# Altium project amplifier.PrjPCB
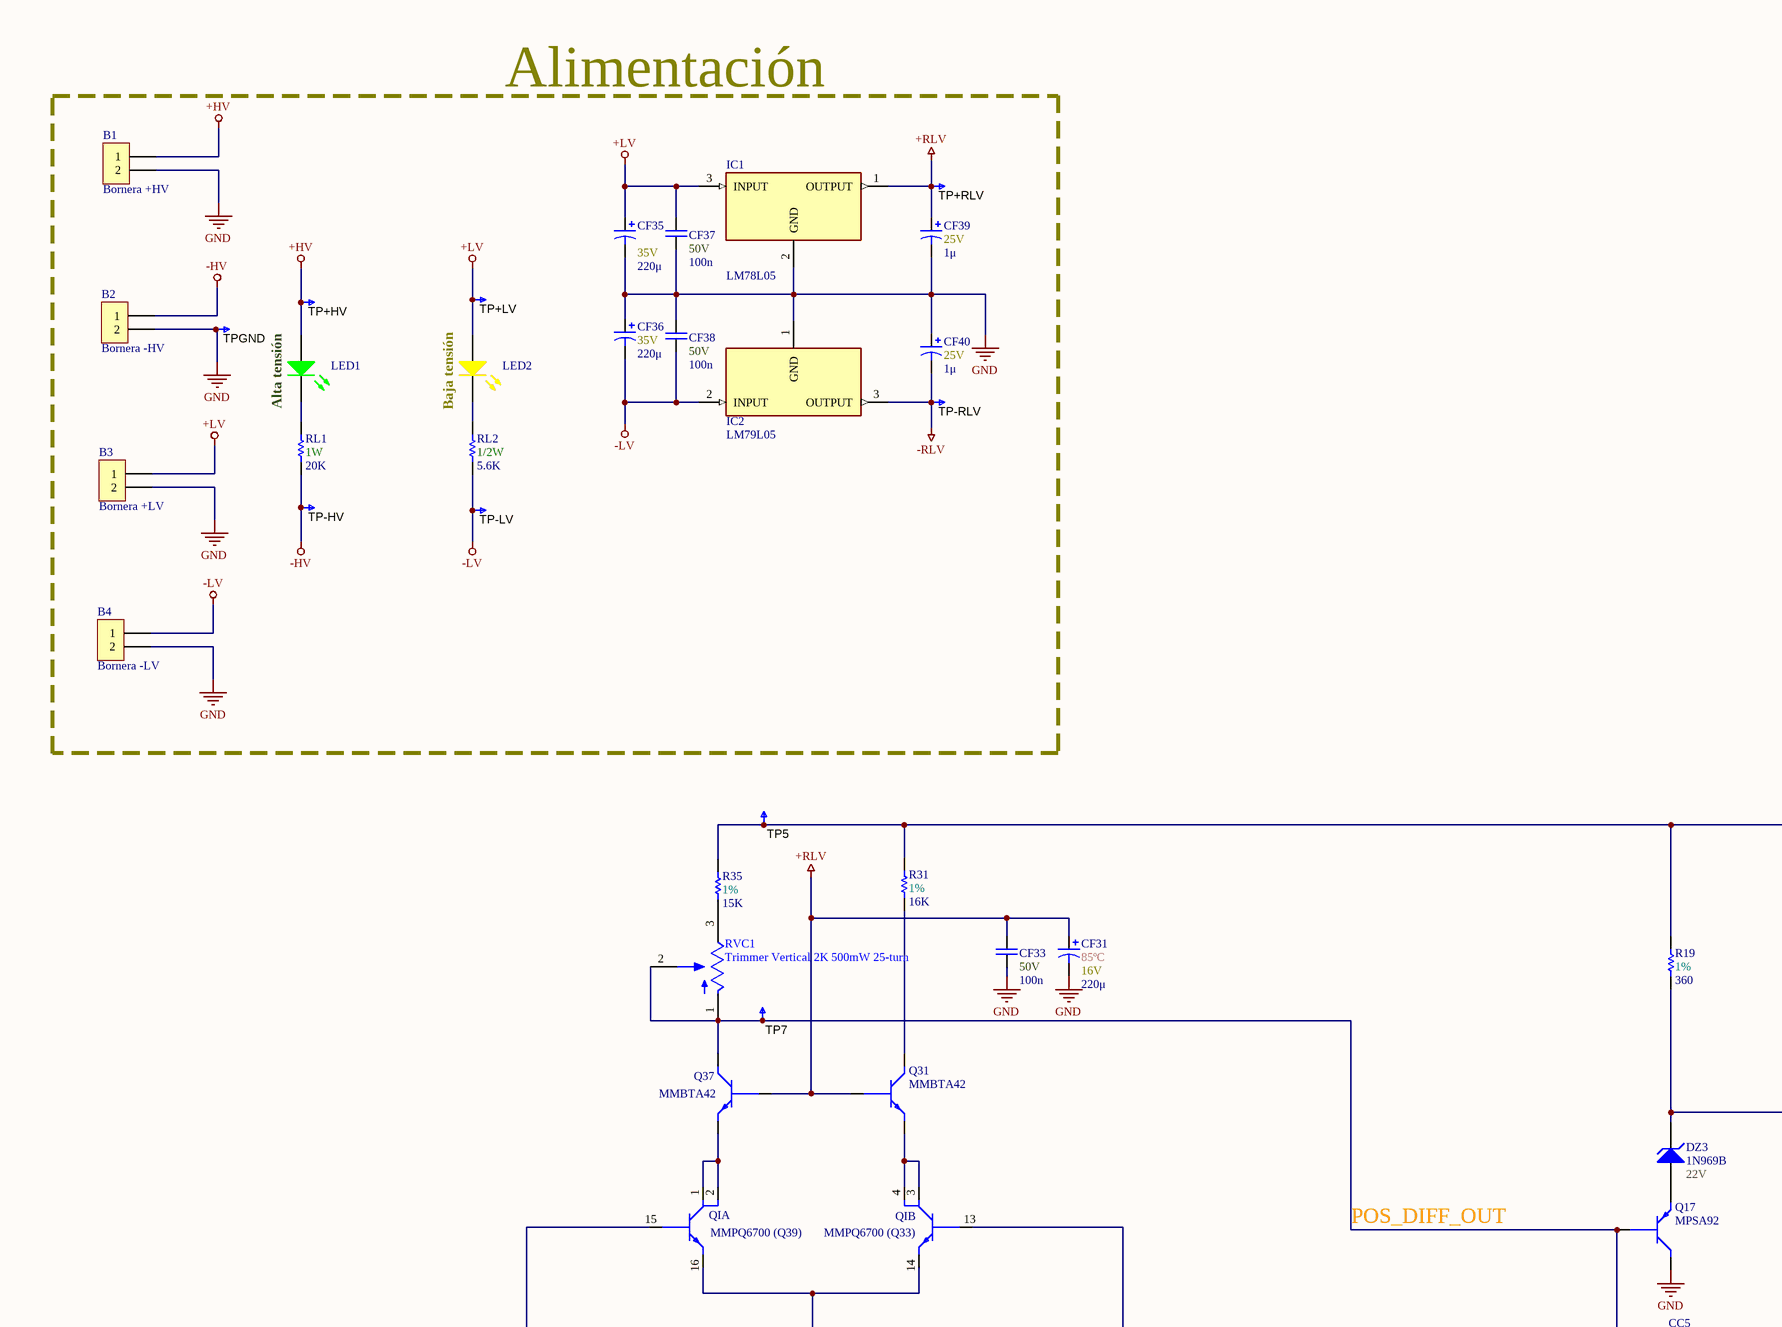
[diagram p0: amplifier.SchDoc, top left]
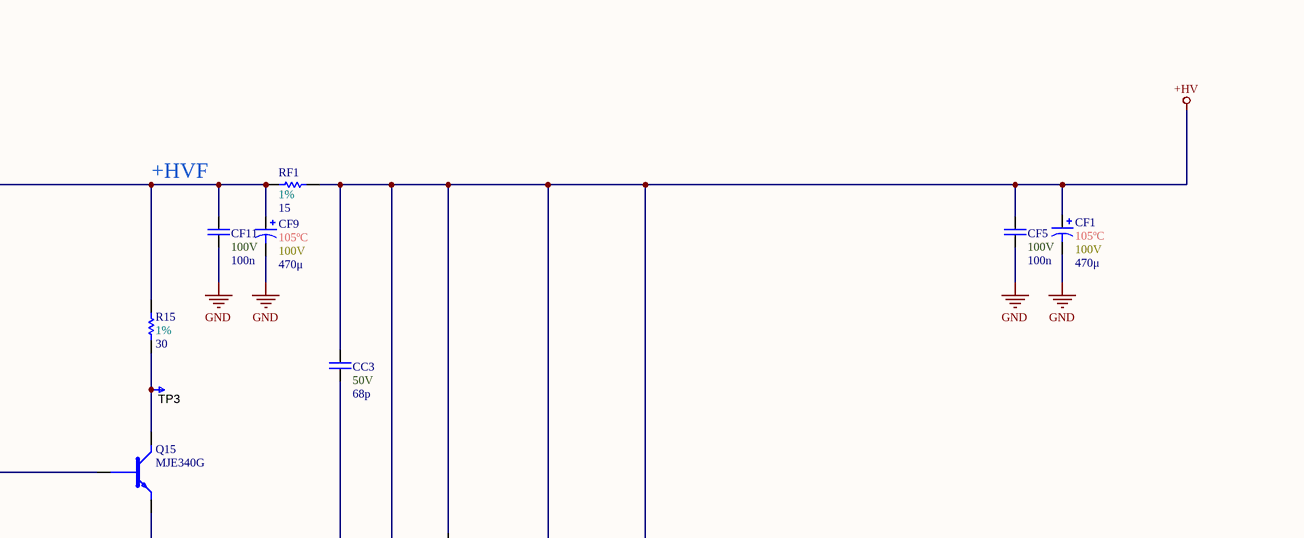
[diagram p1: amplifier.SchDoc, top right]
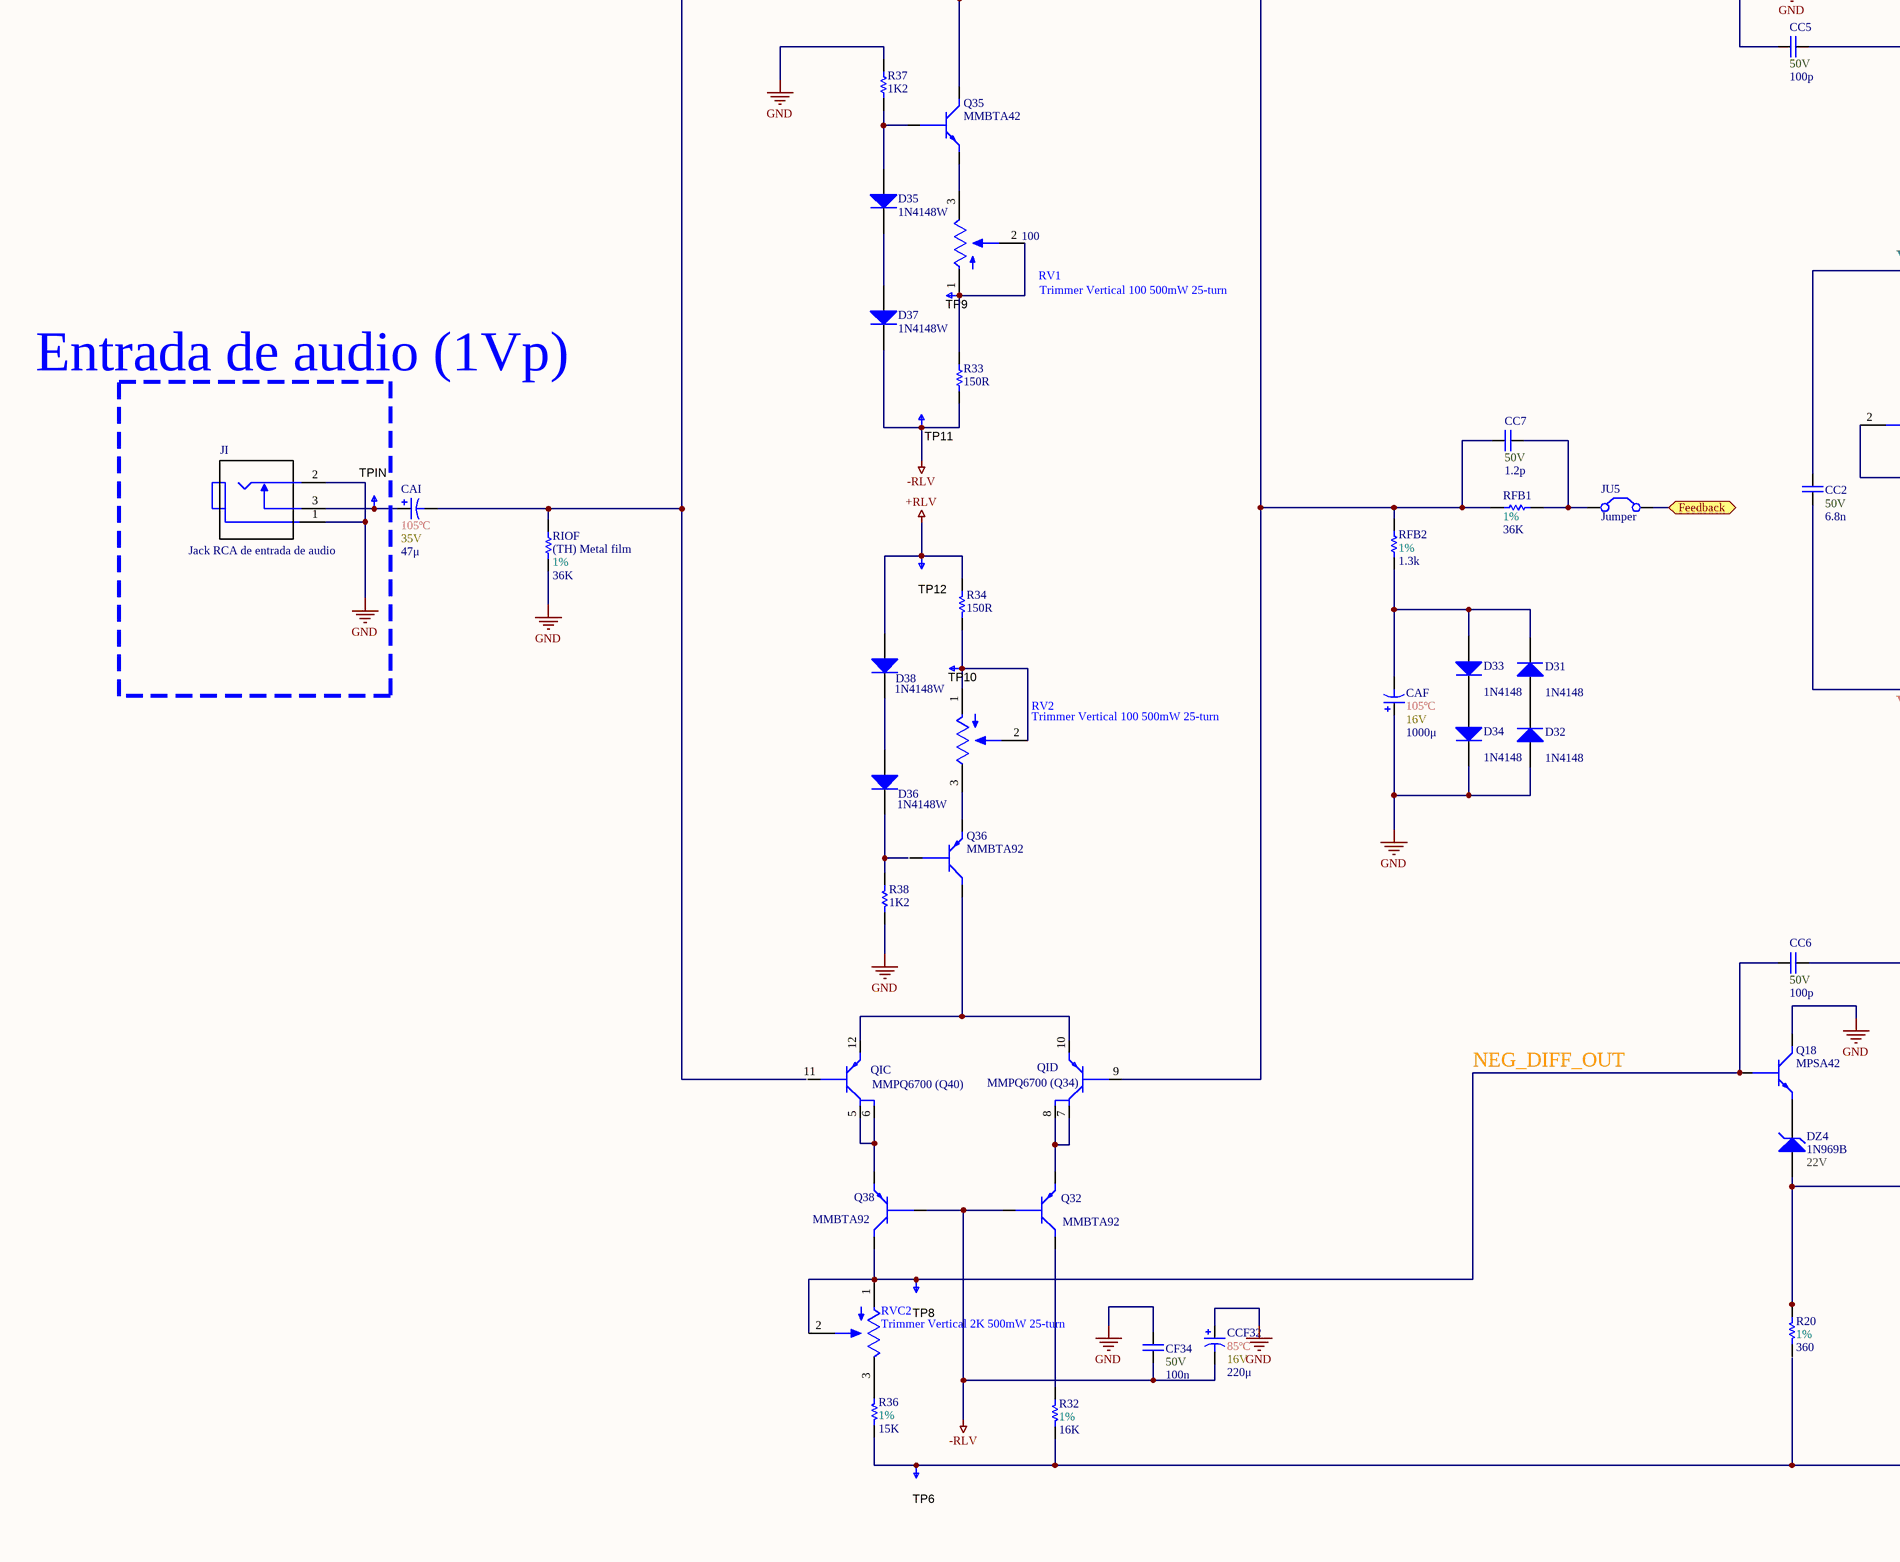
[diagram p2: amplifier.SchDoc, bottom left]
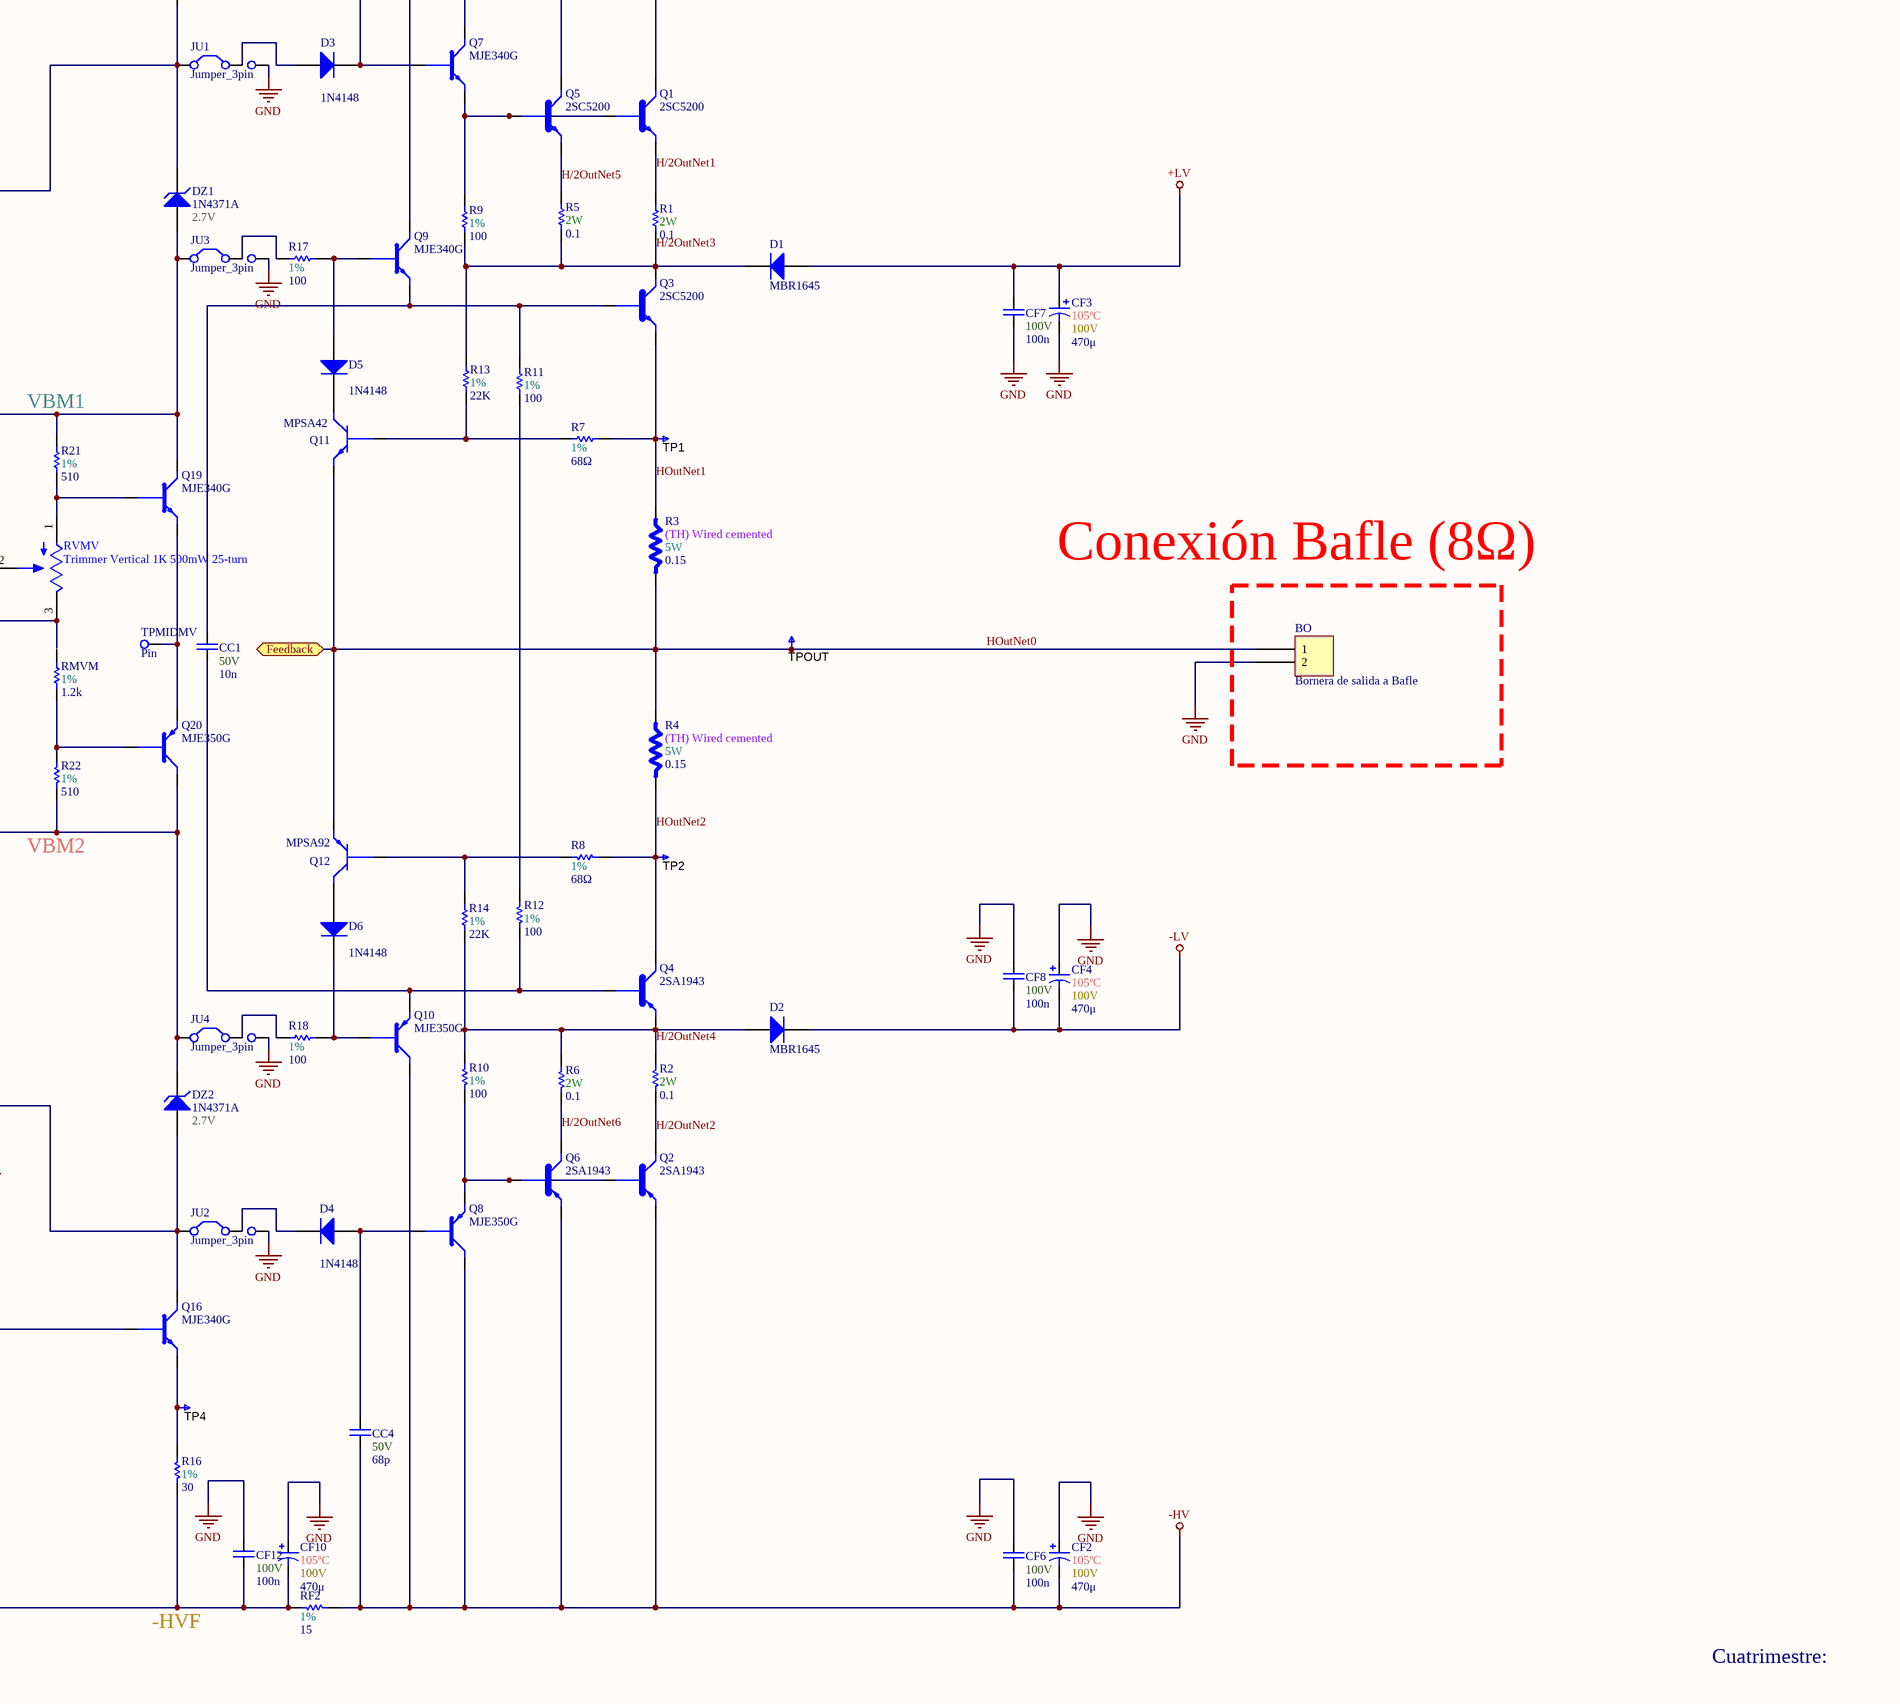
[diagram p3: amplifier.SchDoc, bottom right]
Cuatrimestre: 1º 2019; Grupo: Irusta - Luna - Niero - Romero; Organización: Facultad de ingeniería - UBA; Project Name: Proyecto de Circuitos electrónicos 2 - Amplificador clase G
1 sheet, 154 parts. Net scope: flat (ports and power ports of the same name join across sheets).
Board file: amplifier.PcbDoc

## Sheet amplifier.SchDoc
size A1

### Parts
B1  Bornera +HV  [TE-C-282822-2-C-PLUGGED]
B2  Bornera -HV  [TE-C-282822-2-C-PLUGGED]
B3  Bornera +LV  [TE-C-282822-2-C-PLUGGED]
B4  Bornera -LV  [TE-C-282822-2-C-PLUGGED]
BO  Bornera de salida a Bafle  [TE 8PCV-02-006]
CAF  value 1000μ  Temperature: 105ºC  Voltage: 16V  [Al. Electrolytic 10.0mmx17.0mmx5.0mm-CLEAN]  (hidden comment: Al. Elect. 1000u 16V 20% 105º)
CAI  value 47μ  Temperature: 105ºC  Voltage: 35V  [Al. Electrolytic 6.3mmx11.0mmx2.5mm-CLEAN]  (hidden comment: Al. Elect. 47u 35V 20% 105º)
CC1  value 10n  Voltage: 50V  [Cer. pitch 5.0mm height 5.5mm]  (hidden comment: Cer. 10n 50V 10%)
CC2  value 6.8n  Voltage: 50V  [Cer. pitch 2.5mm height 5.0mm]  (hidden comment: Cer. 6.8n 50V 10%)
CC3  value 68p  Voltage: 50V  [Cer. pitch 5.08mm height 6.00mm]  (hidden comment: Cer. 68p 50V 10%)
CC4  value 68p  Voltage: 50V  [Cer. pitch 5.08mm height 6.00mm]  (hidden comment: Cer. 68p 50V 10%)
CC5  value 100p  Voltage: 50V  [Cer. pitch 5.08mm height 6.00mm]  (hidden comment: Cer. 100p 50V 10%)
CC6  value 100p  Voltage: 50V  [Cer. pitch 5.08mm height 6.00mm]  (hidden comment: Cer. 100p 50V 10%)
CC7  value 1.2p  Voltage: 50V  [Cer. pitch 5.08mm height 6.00mm]  (hidden comment: Cer. 1.2p 50V 10%)
CCF32  value 220μ  Temperature: 85ºC  Voltage: 16V  [Al. Electrolytic 6.3mmx12.0mmx2.5mm-CLEAN]  (hidden comment: Al. Elect. 220u 16V 20% 85º)
CF1  value 470μ  Temperature: 105ºC  Voltage: 100V  [Al. Electrolytic 16.0mmx33.0mmx7.5mm-CLEAN]  (hidden comment: Al. Elect. 470u 100V 20% 105º)
CF2  value 470μ  Temperature: 105ºC  Voltage: 100V  [Al. Electrolytic 16.0mmx33.0mmx7.5mm-CLEAN]  (hidden comment: Al. Elect. 470u 100V 20% 105º)
CF3  value 470μ  Temperature: 105ºC  Voltage: 100V  [Al. Electrolytic 16.0mmx33.0mmx7.5mm-CLEAN]  (hidden comment: Al. Elect. 470u 100V 20% 105º)
CF4  value 470μ  Temperature: 105ºC  Voltage: 100V  [Al. Electrolytic 16.0mmx33.0mmx7.5mm-CLEAN]  (hidden comment: Al. Elect. 470u 100V 20% 105º)
CF5  value 100n  Voltage: 100V  [Cer. pitch 5.0mm height 6.6mm]  (hidden comment: Poly. 100n 100V 10%)
CF6  value 100n  Voltage: 100V  [Cer. pitch 5.0mm height 6.6mm]  (hidden comment: Poly. 100n 100V 10%)
CF7  value 100n  Voltage: 100V  [Cer. pitch 5.0mm height 6.6mm]  (hidden comment: Poly. 100n 100V 10%)
CF8  value 100n  Voltage: 100V  [Cer. pitch 5.0mm height 6.6mm]  (hidden comment: Poly. 100n 100V 10%)
CF9  value 470μ  Temperature: 105ºC  Voltage: 100V  [Al. Electrolytic 16.0mmx33.0mmx7.5mm-CLEAN]  (hidden comment: Al. Elect. 470u 100V 20% 105º)
CF10  value 470μ  Temperature: 105ºC  Voltage: 100V  [Al. Electrolytic 16.0mmx33.0mmx7.5mm-CLEAN]  (hidden comment: Al. Elect. 470u 100V 20% 105º)
CF11  value 100n  Voltage: 100V  [Cer. pitch 5.0mm height 6.6mm]  (hidden comment: Poly. 100n 100V 10%)
CF12  value 100n  Voltage: 100V  [Cer. pitch 5.0mm height 6.6mm]  (hidden comment: Poly. 100n 100V 10%)
CF31  value 220μ  Temperature: 85ºC  Voltage: 16V  [Al. Electrolytic 6.3mmx12.0mmx2.5mm-CLEAN]  (hidden comment: Al. Elect. 220u 16V 20% 85º)
CF33  value 100n  Voltage: 50V  [Cer. pitch 5.0mm height 5.5mm]  (hidden comment: Cer. 100n 50V 10%)
CF34  value 100n  Voltage: 50V  [Cer. pitch 5.0mm height 5.5mm]  (hidden comment: Cer. 100n 50V 10%)
CF35  value 220μ  Voltage: 35V  [Al. Electrolytic 8.0mmx13.0mmx3.5mm-CLEAN]  (hidden comment: Al. Elect. 220u 35V 20% 105º)
CF36  value 220μ  Voltage: 35V  [Al. Electrolytic 8.0mmx13.0mmx3.5mm-CLEAN]  (hidden comment: Al. Elect. 220u 35V 20% 105º)
CF37  value 100n  Voltage: 50V  [Cer. pitch 5.0mm height 5.5mm]  (hidden comment: Cer. 100n 50V 10%)
CF38  value 100n  Voltage: 50V  [Cer. pitch 5.0mm height 5.5mm]  (hidden comment: Cer. 100n 50V 10%)
CF39  value 1μ  Voltage: 25V  [Tantalum Electrolytic 4.5mmx8.0mmx0.254mm-CLEAN]  (hidden comment: Tant. Elect. 1u 25V 10%)
CF40  value 1μ  Voltage: 25V  [Tantalum Electrolytic 4.5mmx8.0mmx0.254mm-CLEAN]  (hidden comment: Tant. Elect. 1u 25V 10%)
D1  MBR1645  [ONSC-TO-220-2-221B-04]
D2  MBR1645  [ONSC-TO-220-2-221B-04]
D3  1N4148  [DO-35-0.3mil]
D4  1N4148  [DO-35-0.3mil]
D5  (no value)  [DO-35-0.3mil]
D6  (no value)  [DO-35-0.3mil]
D31  (no value)  [DO-35-0.3mil]
D32  (no value)  [DO-35-0.3mil]
D33  (no value)  [DO-35-0.3mil]
D34  (no value)  [DO-35-0.3mil]
D35  1N4148W  [SOD-123]
D36  1N4148W  [SOD-123]
D37  1N4148W  [SOD-123]
D38  1N4148W  [SOD-123]
DZ1  1N4371A  ZV: 2.7V  [DO-35-0.3mil]
DZ2  1N4371A  ZV: 2.7V  [DO-35-0.3mil]
DZ3  1N969B  ZV: 22V  [DO-35-0.3mil]
DZ4  1N969B  ZV: 22V  [DO-35-0.3mil]
IC1  LM78L05  [TO-92-1]
IC2  LM79L05  [TO-92-1]
JI  Jack RCA de entrada de audio  [*SWITCHCRAFT_PJRAN1X1U01X]
JU1  Jumper_3pin  [Jumper 200mil 3 pin]
JU2  Jumper_3pin  [Jumper 200mil 3 pin]
JU3  Jumper_3pin  [Jumper 200mil 3 pin]
JU4  Jumper_3pin  [Jumper 200mil 3 pin]
JU5  Jumper  [Jumper 200mil 2 pin]
LED1  Alta tensión  [LED_5MM_GREEN]
LED2  Baja tensión  [LED_5MM_YELLOW]
Q1  2SC5200  [TO-264-3]
Q2  2SA1943  [TO-264-3]
Q3  2SC5200  [TO-264-3]
Q4  2SA1943  [TO-264-3]
Q5  2SC5200  [TO-264-3]
Q6  2SA1943  [TO-264-3]
Q7  MJE340G  [TO-225]
Q8  MJE350G  [TO-225]
Q9  MJE340G  [TO-225]
Q10  MJE350G  [TO-225]
Q11  MPSA42  [TO-92-1]
Q12  MPSA92  [TO-92-1]
Q15  MJE340G  [TO-225]
Q16  MJE340G  [TO-225]
Q17  MPSA92  [TO-92-1]
Q18  MPSA42  [TO-92-1]
Q19  MJE340G  [TO-225]
Q20  MJE350G  [TO-225]
Q31  MMBTA42  [SOT-23]
Q32  MMBTA92  [SOT-23]
Q35  MMBTA42  [SOT-23]
Q36  MMBTA92  [SOT-23]
Q37  MMBTA42  [SOT-23]
Q38  MMBTA92  [SOT-23]
QI  MMPQ6700 (Q39)  [SOIC-16L]  (parts A,B,C,D of 4)
R1  value 0.1  Power: 2W  [AXIAL-0.6-E24-2W-0.1]  (hidden comment: Resistor 0.1 2W 5%)
R2  value 0.1  Power: 2W  [AXIAL-0.6-E24-2W-0.1]  (hidden comment: Resistor 0.1 2W 5%)
R3  value 0.15  Type: (TH) Wired cemented  Power: 5W  [Cemented resistor 0.15 5W 5%]  (hidden comment: Cemented resistor 0.15 5W 5%)
R4  value 0.15  Type: (TH) Wired cemented  Power: 5W  [Cemented resistor 0.15 5W 5%]  (hidden comment: Cemented resistor 0.15 5W 5%)
R5  value 0.1  Power: 2W  [AXIAL-0.6-E24-2W-0.1]  (hidden comment: Resistor 0.1 2W 5%)
R6  value 0.1  Power: 2W  [AXIAL-0.6-E24-2W-0.1]  (hidden comment: Resistor 0.1 2W 5%)
R7  value 68Ω  Tolerance: 1%  [AXIAL-0.4-E24-0_25W-68-1%]  (hidden comment: Resistor 68 1/4W 1%)
R8  value 68Ω  Tolerance: 1%  [AXIAL-0.4-E24-0_25W-68-1%]  (hidden comment: Resistor 68 1/4W 1%)
R9  value 100  Tolerance: 1%  [AXIAL-0.4-E24-0_25W-100-1%]  (hidden comment: Resistor 100 1/4W 1%)
R10  value 100  Tolerance: 1%  [AXIAL-0.4-E24-0_25W-100-1%]  (hidden comment: Resistor 100 1/4W 1%)
R11  value 100  Tolerance: 1%  [AXIAL-0.4-E24-0_25W-100-1%]  (hidden comment: Resistor 100 1/4W 1%)
R12  value 100  Tolerance: 1%  [AXIAL-0.4-E24-0_25W-100-1%]  (hidden comment: Resistor 100 1/4W 1%)
R13  value 22K  Tolerance: 1%  [AXIAL-0.4-E24-0_25W-22k-1%]  (hidden comment: Resistor 22K 1/4W 1%)
R14  value 22K  Tolerance: 1%  [AXIAL-0.4-E24-0_25W-22k-1%]  (hidden comment: Resistor 22K 1/4W 1%)
R15  value 30  Tolerance: 1%  [AXIAL-0.4-E24-0_25W-30-1%]  (hidden comment: Resistor 30 1/4W 1%)
R16  value 30  Tolerance: 1%  [AXIAL-0.4-E24-0_25W-30-1%]  (hidden comment: Resistor 30 1/4W 1%)
R17  value 100  Tolerance: 1%  [AXIAL-0.4-E24-0_25W-100-1%]  (hidden comment: Resistor 100 1/4W 1%)
R18  value 100  Tolerance: 1%  [AXIAL-0.4-E24-0_25W-100-1%]  (hidden comment: Resistor 100 1/4W 1%)
R19  value 360  Tolerance: 1%  [AXIAL-0.4-E24-0_25W-360-1%]  (hidden comment: Resistor 360 1/4W 1%)
R20  value 360  Tolerance: 1%  [AXIAL-0.4-E24-0_25W-360-1%]  (hidden comment: Resistor 360 1/4W 1%)
R21  value 510  Tolerance: 1%  [AXIAL-0.4-E24-0_25W-510-1%]  (hidden comment: Resistor 510 1/4W 1%)
R22  value 510  Tolerance: 1%  [AXIAL-0.4-E24-0_25W-510-1%]  (hidden comment: Resistor 510 1/4W 1%)
R31  value 16K  Tolerance: 1%  [AXIAL-0.4-E24-0_25W-16k-1%]  (hidden comment: Resistor 16K 1/4W 1%)
R32  value 16K  Tolerance: 1%  [AXIAL-0.4-E24-0_25W-16k-1%]  (hidden comment: Resistor 16K 1/4W 1%)
R33  150R  [RES_SM0805_YAGEORC_N]
R34  150R  [RES_SM0805_YAGEORC_N]
R35  value 15K  Tolerance: 1%  [AXIAL-0.4-E24-0_25W-15k-1%]  (hidden comment: Resistor 15K 1/4W 1%)
R36  value 15K  Tolerance: 1%  [AXIAL-0.4-E24-0_25W-15k-1%]  (hidden comment: Resistor 15K 1/4W 1%)
R37  1K2  [RES_SM0603_YAGEORC_N]
R38  1K2  [RES_SM0603_YAGEORC_N]
RF1  value 15  Tolerance: 1%  [AXIAL-0.4-E24-0_25W-15-1%]  (hidden comment: Resistor 15 1/4W 1%)
RF2  value 15  Tolerance: 1%  [AXIAL-0.4-E24-0_25W-15-1%]  (hidden comment: Resistor 15 1/4W 1%)
RFB1  value 36K  Tolerance: 1%  [AXIAL-0.4-E24-0_25W-36k-1%]  (hidden comment: Resistor 36K 1/4W 1%)
RFB2  value 1.3k  Tolerance: 1%  [AXIAL-0.4-E24-0_25W-1.3k-1%]  (hidden comment: Resistor 1.3k 1/4W 1%)
RIOF  value 36K  Type: (TH) Metal film  Tolerance: 1%  [AXIAL-0.4-E24-0_25W-36k-1%]  (hidden comment: Resistor 36K 1/4W 1%)
RL1  value 20K  Power: 1W  [AXIAL-0.6-E24-1W-20K]  (hidden comment: Resistor 20K 1W 5%)
RL2  value 5.6K  Power: 1/2W  [AXIAL-0.5-E24-0_5W-5.6K]  (hidden comment: Resistor 5.6K 1/2W 5%)
RMVM  value 1.2k  Tolerance: 1%  [AXIAL-0.4-E24-0_25W-1.2k-1%]  (hidden comment: Resistor 1.2k 1/4W 1%)
RV1  Trimmer Vertical 100 500mW 25-turn  value 100  [POT_3296W]
RV2  Trimmer Vertical 100 500mW 25-turn  [POT_3296W]
RVC1  Trimmer Vertical 2K 500mW 25-turn  [POT_3296W]
RVC2  Trimmer Vertical 2K 500mW 25-turn  [POT_3296W]
RVMV  Trimmer Vertical 1K 500mW 25-turn  [POT_3296W]
TP1  TESTPOINT_THT  [TP-THT-MULTI]  (value not drawn)
TP2  TESTPOINT_THT  [TP-THT-MULTI]  (value not drawn)
TP3  TESTPOINT_THT  [TP-THT-MULTI]  (value not drawn)
TP4  TESTPOINT_THT  [TP-THT-MULTI]  (value not drawn)
TP5  TESTPOINT_THT  [TP-THT-MULTI]  (value not drawn)
TP6  TESTPOINT_THT  [TP-THT-MULTI]  (value not drawn)
TP7  TESTPOINT_THT  [TP-THT-MULTI]  (value not drawn)
TP8  TESTPOINT_THT  [TP-THT-MULTI]  (value not drawn)
TP9  TESTPOINT_THT  [TP-THT-MULTI]  (value not drawn)
TP10  TESTPOINT_THT  [TP-THT-MULTI]  (value not drawn)
TP11  TESTPOINT_THT  [TP-THT-MULTI]  (value not drawn)
TP12  TESTPOINT_THT  [TP-THT-MULTI]  (value not drawn)
TP+HV  TESTPOINT_THT  [TP-THT-MULTI]  (value not drawn)
TP+LV  TESTPOINT_THT  [TP-THT-MULTI]  (value not drawn)
TP+RLV  TESTPOINT_THT  [TP-THT-MULTI]  (value not drawn)
TP-HV  TESTPOINT_THT  [TP-THT-MULTI]  (value not drawn)
TP-LV  TESTPOINT_THT  [TP-THT-MULTI]  (value not drawn)
TP-RLV  TESTPOINT_THT  [TP-THT-MULTI]  (value not drawn)
TPGND  TESTPOINT_THT  [TP-THT-MULTI]  (value not drawn)
TPIN  TESTPOINT_THT  [TP-THT-MULTI]  (value not drawn)
TPMIDMV  Pin  [Jumper 200mil 1 pin]
TPOUT  TESTPOINT_THT  [TP-THT-MULTI]  (value not drawn)

### Blocks framed on the sheet
Alimentación: B1-B4 CF35-CF40 IC1 IC2 LED1 LED2 RL1 RL2 TP+HV TP+LV TP+RLV TP-HV TP-LV TP-RLV TPGND

### Ports
Feedback (bidir)

### Nets
+HV: B1.1 CC3.2 CF1.1 CF5.2 LED1.A Q1.2(C) Q5.2(C) Q7.2(C) Q9.2(C) RF1.2 TP+HV.1
+LV: B3.1 CF3.1 CF7.2 CF35.1 CF37.2 D1.3(A) IC1.3(INPUT) LED2.A TP+LV.1
+RLV: CF31.1 CF33.2 CF39.1 D38.2(A) IC1.1(OUTPUT) Q31.1(B) Q37.1(B) R34.1 TP12.1 TP+RLV.1
-HV: B2.1 CC4.1 CF2.2 CF6.1 Q2.3(E) Q6.3(E) Q8.2(C) Q10.2(C) RF2.2 RL1.1 TP-HV.1
-LV: B4.1 CF4.2 CF8.1 CF36.2 CF38.1 D2.1(K) IC2.2(INPUT) RL2.1 TP-LV.1
-RLV: CCF32.2 CF34.2 CF40.2 D37.1(K) IC2.3(OUTPUT) Q32.1(B) Q38.1(B) R33.1 TP11.1 TP-RLV.1
GND: B1.2 B2.2 B3.2 B4.2 BO.2 CAF.1 CCF32.1 CF1.2 CF2.1 CF3.2 CF4.1 CF5.1 CF6.2 CF7.1 CF8.2 CF9.2 CF10.1 CF11.1 CF12.1 CF31.2 CF33.1 CF34.1 CF35.2 CF36.1 CF37.1 CF38.2 CF39.2 CF40.1 D32.2(A) D34.1(K) IC1.2(GND) IC2.1(GND) JI.1 JI.2 JU1.3(C3) JU2.3(C3) JU3.3(C3) JU4.3(C3) Q17.3(C) Q18.3(C) R37.2 R38.2 RIOF.2 TPGND.1
+HVF: CF9.1 CF11.2 R15.2 R19.2 R31.2 R35.2 RF1.1 TP5.1
-HVF: CF10.2 CF12.2 R16.2 R32.2 R36.2 RF2.1 TP6.1
H/2OutNet1: Q1.3(E) R1.2
H/2OutNet2: Q2.2(C) R2.1
H/2OutNet3: D1.1(K) Q3.2(C) R1.1 R5.1 R9.1 R13.2
H/2OutNet4: D2.3(A) Q4.3(E) R2.2 R6.2 R10.2 R14.1
H/2OutNet5: Q5.3(E) R5.2
H/2OutNet6: Q6.2(C) R6.1
HOutNet0: BO.1 JU5.2(C2) Q11.1(E) Q12.1(E) R3.2 R4.1 TPOUT.1 ; port Feedback
HOutNet1: Q3.3(E) R3.1 R7.2 TP1.1
HOutNet2: Q4.2(C) R4.2 R8.1 TP2.1
NEG_DIFF_OUT: CC6.2 Q18.2(B) Q38.3(C) RVC2.1(A) RVC2.2(B) TP8.1
POS_DIFF_OUT: CC5.1 Q17.2(B) Q37.3(C) RVC1.1(A) RVC1.2(B) TP7.1
VBM1: CC2.2 DZ1.1(A) JU3.1(C1) Q19.2(C) R21.2
VBM2: CC2.1 DZ2.2(K) JU4.1(C1) Q20.2(C) R22.1
NetCAF_2: CAF.2 D31.1(K) D33.2(A) RFB2.1
NetCAI_1: CAI.1 JI.3 TPIN.1
NetCAI_2: CAI.2 QI.15(B1) RIOF.1
NetCC1_1: CC1.1 Q4.1(B) Q10.1(E) R12.1
NetCC1_2: CC1.2 Q3.1(B) Q9.1(E) R11.2
NetCC3_1: CC3.1 D3.1(K) Q7.3(B)
NetCC4_2: CC4.2 D4.2(A) Q8.3(B)
NetCC5_2: CC5.2 DZ1.2(K) JU1.1(C1) Q15.1(E)
NetCC6_1: CC6.1 DZ2.1(A) JU2.1(C1) Q16.2(C)
NetCC7_1: CC7.1 QI.9(B4) QI.13(B2) RFB1.1 RFB2.2
NetCC7_2: CC7.2 JU5.1(C1) RFB1.2
NetD3_2: D3.2(A) JU1.2(C2)
NetD4_1: D4.1(K) JU2.2(C2)
NetD5_1: D5.1(K) Q11.3(C)
NetD5_2: D5.2(A) Q9.3(B) R17.2
NetD6_1: D6.1(K) Q10.3(B) R18.1
NetD6_2: D6.2(A) Q12.3(C)
NetD31_2: D31.2(A) D32.1(K)
NetD33_1: D33.1(K) D34.2(A)
NetD35_1: D35.1(K) D37.2(A)
NetD35_2: D35.2(A) Q35.1(B) R37.1
NetD36_1: D36.1(K) R38.1
NetD36_2: D36.2(A) D38.1(K)
NetDZ3_1: DZ3.1(A) Q17.1(E)
NetDZ3_2: DZ3.2(K) Q15.3(B) R19.1
NetDZ4_1: DZ4.1(A) Q16.3(B) R20.2
NetDZ4_2: DZ4.2(K) Q18.1(E)
NetJU3_2: JU3.2(C2) R17.1
NetJU4_2: JU4.2(C2) R18.2
NetLED1_K: LED1.K RL1.2
NetLED2_K: LED2.K RL2.2
NetQ1_1: Q1.1(B) Q5.1(B) Q7.1(E) R9.2
NetQ2_1: Q2.1(B) Q6.1(B) Q8.1(E) R10.1
NetQ11_2: Q11.2(B) R7.1 R13.1
NetQ12_2: Q12.2(B) R8.2 R14.2
NetQ15_2: Q15.2(C) R15.1 TP3.1
NetQ16_1: Q16.1(E) R16.1 TP4.1
NetQ19_1: Q19.1(E) Q20.1(E) TPMIDMV.1(C1)
NetQ19_3: Q19.3(B) R21.1 RVMV.1(A)
NetQ20_3: Q20.3(B) R22.2 RMVM.1
NetQ31_2: Q31.2(E) QI.3(C2) QI.4(C2)
NetQ31_3: Q31.3(C) R31.1
NetQ32_2: Q32.2(E) QI.7(C4) QI.8(C4)
NetQ32_3: Q32.3(C) R32.1
NetQ35_2: Q35.2(E) RV1.3(C)
NetQ35_3: Q35.3(C) QI.14(E2) QI.16(E1)
NetQ36_2: Q36.2(E) RV2.3(C)
NetQ36_3: Q36.3(C) QI.10(E4) QI.12(E3)
NetQ37_2: Q37.2(E) QI.1(C1) QI.2(C1)
NetQ38_2: Q38.2(E) QI.5(C3) QI.6(C3)
NetR11_1: R11.1 R12.2
NetR33_2: R33.2 RV1.1(A) RV1.2(B) TP9.1
NetR34_2: R34.2 RV2.1(A) RV2.2(B) TP10.1
NetR35_1: R35.1 RVC1.3(C)
NetR36_1: R36.1 RVC2.3(C)
NetRVMV_2: RVMV.2(B) RVMV.3(C)

Not connected (* = marked no-connect by the designer): Q36 1(B); QI 11(B3); R20 1; RMVM 2

### Notes on the sheet
- Entrada de audio (1Vp)
- Conexión Bafle (8Ω)
- Cuatrimestre:

### Library data of the parts
B1-B4 = C-282822-2-C: TERMI-BLOK HEADER,ASSY90 2P - serie 282822 - 5.00mm; Manufacturer: TE Connectivity; ComponentLink1 Description: Manufacturer; ComponentLink2 Description: Datasheet; NoPins: 02; Created Date: 6 MArch 2017; partNo: C-282822-2-C; ComponentLink1URL: http://www.te.com/usa-en/home.html; ComponentLink2URL: http://www.te.com/usa-en/product-282822-2.html
BO = 8PCV-02-006: TE Barrier Terminal Block, 2P; Current: 30A; Voltage: 600V
CAF = Al. Elect. 1000u 16V 20% 105º: Aluminum Electrolytic Capacitor 1000μF 16V 20% 105º; Application: Medium and high voltage type range from 160V-450V used as primary side input filter in power supply, which can be used in general switching power supply, PC power supply and industrial computer power supply,server power supply, AC-DC converter, motor drive circuit DC storage filter, digital audio, digital TV, communication base station, DC-AC inverter, inverter power supply and converters etc; Characteristics: Aluminum Electrolytic Capacitor; Tolerance: 20%; Price: *; Supplier: *; Power: *
CAI = Al. Elect. 47u 35V 20% 105º: Aluminum Electrolytic Capacitor 47μF 35V 20% 105º; Application: Medium and high voltage type range from 160V-450V used as primary side input filter in power supply, which can be used in general switching power supply, PC power supply and industrial computer power supply,server power supply, AC-DC converter, motor drive circuit DC storage filter, digital audio, digital TV, communication base station, DC-AC inverter, inverter power supply and converters etc; Characteristics: Aluminum Electrolytic Capacitor; Tolerance: 20%; Price: *; Supplier: *; Power: *
CC1 = Cer. 10n 50V 10%: Ceramic Capacitor 10nF 50V 10%; Application: Medium and high voltage type range from 160V-450V used as primary side input filter in power supply, which can be used in general switching power supply, PC power supply and industrial computer power supply,server power supply, AC-DC converter, motor drive circuit DC storage filter, digital audio, digital TV, communication base station, DC-AC inverter, inverter power supply and converters etc; Characteristics: Ceramic Capacitor; Tolerance: 10%; Price: *; Power: *; Supplier: *
CC2 = Cer. 6.8n 50V 10%: Ceramic Capacitor 6.8nF 50V 10%; Application: Medium and high voltage type range from 160V-450V used as primary side input filter in power supply, which can be used in general switching power supply, PC power supply and industrial computer power supply,server power supply, AC-DC converter, motor drive circuit DC storage filter, digital audio, digital TV, communication base station, DC-AC inverter, inverter power supply and converters etc; Characteristics: Ceramic Capacitor; Tolerance: 10%; Price: *; Power: *; Supplier: *
CC3 CC4 = Cer. 68p 50V 10%: Ceramic Capacitor 68pF 50V 10%; Application: Medium and high voltage type range from 160V-450V used as primary side input filter in power supply, which can be used in general switching power supply, PC power supply and industrial computer power supply,server power supply, AC-DC converter, motor drive circuit DC storage filter, digital audio, digital TV, communication base station, DC-AC inverter, inverter power supply and converters etc; Characteristics: Ceramic Capacitor; Tolerance: 10%; Price: *; Power: *; Supplier: *
CC5 CC6 = Cer. 100p 50V 10%: Ceramic Capacitor 100pF 50V 10%; Application: Medium and high voltage type range from 160V-450V used as primary side input filter in power supply, which can be used in general switching power supply, PC power supply and industrial computer power supply,server power supply, AC-DC converter, motor drive circuit DC storage filter, digital audio, digital TV, communication base station, DC-AC inverter, inverter power supply and converters etc; Characteristics: Ceramic Capacitor; Tolerance: 10%; Price: *; Power: *; Supplier: *
CC7 = Cer. 1.2p 50V 10%: Ceramic Capacitor 1.2pF 50V 10%; Application: Medium and high voltage type range from 160V-450V used as primary side input filter in power supply, which can be used in general switching power supply, PC power supply and industrial computer power supply,server power supply, AC-DC converter, motor drive circuit DC storage filter, digital audio, digital TV, communication base station, DC-AC inverter, inverter power supply and converters etc; Characteristics: Ceramic Capacitor; Tolerance: 10%; Price: *; Power: *; Supplier: *
CCF32 CF31 = Al. Elect. 220u 16V 20% 85º: Aluminum Electrolytic Capacitor 220μF 16V 20% 85º; Application: Medium and high voltage type range from 160V-450V used as primary side input filter in power supply, which can be used in general switching power supply, PC power supply and industrial computer power supply,server power supply, AC-DC converter, motor drive circuit DC storage filter, digital audio, digital TV, communication base station, DC-AC inverter, inverter power supply and converters etc; Characteristics: Aluminum Electrolytic Capacitor; Tolerance: 20%; Price: *; Supplier: *; Power: *
CF1-CF4 CF9 CF10 = Al. Elect. 470u 100V 20% 105º: Aluminum Electrolytic Capacitor 470μF 100V 20% 105º; Application: Medium and high voltage type range from 160V-450V used as primary side input filter in power supply, which can be used in general switching power supply, PC power supply and industrial computer power supply,server power supply, AC-DC converter, motor drive circuit DC storage filter, digital audio, digital TV, communication base station, DC-AC inverter, inverter power supply and converters etc; Characteristics: Aluminum Electrolytic Capacitor; Tolerance: 20%; Price: *; Supplier: *; Power: *
CF5-CF8 CF11 CF12 = Poly. 100n 100V 10%: Polyester Capacitor 100nF 100V 10%; Application: Medium and high voltage type range from 160V-450V used as primary side input filter in power supply, which can be used in general switching power supply, PC power supply and industrial computer power supply,server power supply, AC-DC converter, motor drive circuit DC storage filter, digital audio, digital TV, communication base station, DC-AC inverter, inverter power supply and converters etc; Characteristics: Polyester Capacitor; Tolerance: 10%; Supplier: *; Price: *; Power: *
CF33 CF34 CF37 CF38 = Cer. 100n 50V 10%: Ceramic Capacitor 100nF 50V 10%; Application: Medium and high voltage type range from 160V-450V used as primary side input filter in power supply, which can be used in general switching power supply, PC power supply and industrial computer power supply,server power supply, AC-DC converter, motor drive circuit DC storage filter, digital audio, digital TV, communication base station, DC-AC inverter, inverter power supply and converters etc; Characteristics: Ceramic Capacitor; Tolerance: 10%; Supplier: *; Price: *; Power: *
CF35 CF36 = Al. Elect. 220u 35V 20% 105º: Aluminum Electrolytic Capacitor 220μF 35V 20% 105º; Application: Medium and high voltage type range from 160V-450V used as primary side input filter in power supply, which can be used in general switching power supply, PC power supply and industrial computer power supply,server power supply, AC-DC converter, motor drive circuit DC storage filter, digital audio, digital TV, communication base station, DC-AC inverter, inverter power supply and converters etc; Characteristics: Aluminum Electrolytic Capacitor; Tolerance: 20%; Price: *; Supplier: *; Power: *; Temperature: 105ºC
CF39 CF40 = Tant. Elect. 1u 25V 10%: Tantalum Electrolytic Capacitor 1μF 25V 10%; Application: Medium and high voltage type range from 160V-450V used as primary side input filter in power supply, which can be used in general switching power supply, PC power supply and industrial computer power supply,server power supply, AC-DC converter, motor drive circuit DC storage filter, digital audio, digital TV, communication base station, DC-AC inverter, inverter power supply and converters etc; Characteristics: Tantalum Electrolytic Capacitor; Tolerance: 10%; Temperature: *; Price: *; Supplier: *; Power: *
D1 D2 = MBR1645: 45 V, 16 A SWITCHMODE(TM) Schottky Power Rectifier, 2-Pin TO-220, Pb-Free, Tube; Manufacturer_Name: ON Semiconductor; Manufacturer_Part_Number: MBR1645; ComponentLink1Description: Manufacturer URL; ComponentLink1URL: http://www.onsemi.com/; ComponentLink2Description: Datasheet; ComponentLink2URL: http://www.onsemi.com/pub_link/Collateral/MSR1560-D.PDF; ComponentLink3Description: Package Specification; ComponentLink3URL: http://www.onsemi.com/pub_link/Collateral/221B-04.PDF; Power: *; Price: *; Supplier: *
D3-D6 D31-D34 = 1N4148: FAST SWITCHING DIODE; Manufacturer: ON Semiconductors; Power: 400mW; VR: 71V; IFM: 30mA; ComponentLink1Description: ON Semi. product information; ComponentLink1URL: https://www.onsemi.com/PowerSolutions/product.do?id=1N4148; ComponentLink2Description: Datasheet; ComponentLink2URL: https://www.onsemi.com/pub/Collateral/1N914A-D.pdf; Supplier: *; Price: *; PartNumber: 1N4148
D35-D38 = 1N4148W: SURFACE MOUNT FAST SWITCHING DIODE; Manufacturer: Diodes Incorporated; Power: 400mW; VR: 71V; IFM: 30mA; PartNumber: 1N4148W; ComponentLink1Description: DIODES INC. product information; ComponentLink1URL: https://www.diodes.com/products/discrete/diodes-and-rectifiers/diodes/small-signal-switching-diodes/part/1N4148W; ComponentLink2Description: Datasheet; ComponentLink2URL: https://www.diodes.com/assets/Datasheets/ds30086.pdf; Supplier: *; Price: *
DZ1 DZ2 = 1N4371A: Zener Diode, 2.7V, 500mW; Manufacturer: Microsemi; IZT: 20mA; Published: 8-Jun-2000; LatestRevisionDate: 17-Jul-2002; LatestRevisionNote: Re-released for DXP Platform.; DatasheetDocument: 1997; PackageReference: DO-35; Publisher: Altium Limited; Code_JEDEC: DO-204-AH; ComponentLink2Description: Datasheet; ComponentLink2URL: https://www.microsemi.com/document-portal/doc_download/5906-1n746-759a-4370-4372a-datasheet; PartNumber: 1N4371A; Power: 500mW; Supplier: *; Price: *; ComponentLink3Description: Microsemi product information; ComponentLink3URL: https://www.microsemi.com/existing-parts/parts/121290#resources
DZ3 DZ4 = 1N969B: Zener Diode, 22V, 500mW; Manufacturer: Microsemi; IZT: 20mA; Published: 8-Jun-2000; LatestRevisionDate: 17-Jul-2002; LatestRevisionNote: Re-released for DXP Platform.; DatasheetDocument: 1997; PackageReference: DO-35; Publisher: Altium Limited; Code_JEDEC: DO-204-AH; ComponentLink2Description: Datasheet; ComponentLink2URL: https://www.microsemi.com/document-portal/doc_download/5906-1n746-759a-4370-4372a-datasheet; PartNumber: 1N969B; Power: 500mW; Supplier: *; Price: *; ComponentLink3Description: Microsemi product information; ComponentLink3URL: https://www.microsemi.com/existing-parts/parts/121290#resources
IC1 = LM78L05: 5V fixed regulator - 100mA; Manufacturer_Part_Number: LM7805; Height: 4.7mm; Power: *; Price: *; Supplier: *
IC2 = LM79L05: -5V fixed regulator - 100mA; Manufacturer_Part_Number: LM7805; Height: 4.7mm; Power: *; Price: *; Supplier: *
JI = PJRAN1X1U01X: Conn Phono Jack F 3 POS Solder RA Thru-Hole 3 Terminal 1 Port; MF: Switchcraft; Package: None; Price: None; MP: PJRAN1X1U01X; Availability: Unavailable; SnapEDA_Link: https://www.snapeda.com/parts/PJRAN1X1U01X/Switchcraft%20Inc./view-part/?ref=snap; Value: *
JU1-JU4 = Jumper_3pin: Jumper Wire; Published: 24-Mar-1999; LatestRevisionDate: 17-Jul-2002; LatestRevisionNote: Re-released for DXP Platform.; PackageReference: RAD-0.2; Publisher: Altium Limited; PackageDescription: Radial Cap, Thru-Hole; 2 Leads; 0.2 in Pin Spacing
JU5 = Jumper: Jumper Wire; Published: 24-Mar-1999; LatestRevisionDate: 17-Jul-2002; LatestRevisionNote: Re-released for DXP Platform.; PackageReference: RAD-0.2; Publisher: Altium Limited; PackageDescription: Radial Cap, Thru-Hole; 2 Leads; 0.2 in Pin Spacing
LED1 = LED (GREEN): Typical LED (GREEN); Publisher: Altium Limited
LED2 = LED (YELLOW): Typical LED (YELLOW); Publisher: Altium Limited
Q1 Q3 Q5 = 2SC5200: Transistor GP BJT NPN 230V 15A 3-Pin_3+Tab_ TO-264 Tube; Manufacturer: Toshiba; Power: 150W; Price: *; PartNumber: 2SC5200; ComponentLink1Description: Toshiba product information; ComponentLink1URL: https://toshiba.semicon-storage.com/ap-en/product/bipolar-transistor/bipolar-transistor/detail.2SC5200.html; ComponentLink2Description: Datasheet; ComponentLink2URL: https://toshiba.semicon-storage.com/info/docget.jsp?did=20668&prodName=2SC5200; IC: 15A; VCEO: 230V; VCBO: 230V
Q2 Q4 Q6 = 2SA1943: Transistor GP BJT PNP 230V 15A 3-Pin_3+Tab_ TO-264 Tube; Manufacturer: Toshiba; Power: 150W; VCBO: -230V; IC: -15A; PartNumber: 2SA1943; Price: *; ComponentLink1Description: Toshiba product information; ComponentLink1URL: https://toshiba.semicon-storage.com/ap-en/product/bipolar-transistor/bipolar-transistor/detail.2SA1943.html; ComponentLink2Description: Datasheet; ComponentLink2URL: https://toshiba.semicon-storage.com/info/docget.jsp?did=20426&prodName=2SA1943; VCEO: -230V
Q7 Q9 Q15 Q16 Q19 = MJE340G: Plastic Medium-Power NPN Silicon Transistor, 300 VOLTS, 0.5 AMPERE, 20 WATTS; Manufacturer: ON Semiconductor; VCEO: 300V; IC: 500mA; Power: 20W; PartNumber: MJE340G; ComponentLink1Description: ON semiconductor product information; ComponentLink1URL: https://www.onsemi.com/PowerSolutions/product.do?id=MJE340G; ComponentLink2Description: Datasheet; ComponentLink2URL: https://www.onsemi.com/pub/Collateral/MJE340-D.PDF; Price: *; Supplier: *; VCB: 300V
Q8 Q10 Q20 = MJE350G: Plastic Medium-Power PNP Silicon Transistor, 300 VOLTS, 0.5 AMPERE, 20 WATTS; Manufacturer: ON Semiconductor; Power: 20W; IC: 500mA; VCEO: 300V; PartNumber: MJE350G; ComponentLink1Description: ON semiconductor product information; ComponentLink1URL: https://www.onsemi.com/PowerSolutions/product.do?id=MJE350G; ComponentLink2Description: Datasheet; ComponentLink2URL: https://www.onsemi.com/pub/Collateral/MJE350-D.PDF; Price: *; Supplier: *; VCB: 300V
Q11 Q18 = MPSA42: High Voltage NPN Bipolar Transistor; Manufacturer: ON Semiconductor; PartNumber: MJE340G; VCEO: 300V; IC: 500mA; Power: 20W; ComponentLink1Description: ON semiconductor product information; ComponentLink1URL: https://www.onsemi.com/PowerSolutions/product.do?id=MPSA42; ComponentLink2Description: Datasheet; ComponentLink2URL: https://www.onsemi.com/pub/Collateral/MPSA42-D.PDF; Price: *; Supplier: *; VCB: 300V
Q12 Q17 = MPSA92: High Voltage PNP Bipolar Transistor; Manufacturer: ON Semiconductor; PartNumber: MJE340G; VCEO: 300V; IC: 500mA; Power: 20W; ComponentLink1Description: ON semiconductor product information; ComponentLink1URL: https://www.onsemi.com/PowerSolutions/product.do?id=MPSA92; ComponentLink2Description: Datasheet; ComponentLink2URL: https://www.onsemi.com/pub/Collateral/MPSA92-D.PDF; Price: *; Supplier: *; VCB: 300V
Q31 Q35 Q37 = MMBTA42: High Voltage NPN Bipolar Transistor; Manufacturer: ON Semiconductor; PartNumber: MJE340G; VCEO: 300V; IC: 500mA; Power: 20W; ComponentLink1Description: ON semiconductor product information; ComponentLink1URL: https://www.onsemi.com/PowerSolutions/product.do?id=MMBTA42; ComponentLink2Description: Datasheet; ComponentLink2URL: https://www.onsemi.com/pub/Collateral/PZTA42-D.pdf; Price: *; Supplier: *; VCB: 300V
Q32 Q36 Q38 = MMBTA92: High Voltage PNP Bipolar Transistor; Manufacturer: ON Semiconductor; PartNumber: MJE340G; VCEO: 300V; IC: 500mA; Power: 20W; ComponentLink1Description: ON semiconductor product information; ComponentLink1URL: https://www.onsemi.com/PowerSolutions/product.do?id=MMBTA92; ComponentLink2Description: Datasheet; ComponentLink2URL: https://www.onsemi.com/pub/Collateral/PZTA92-D.pdf; Price: *; Supplier: *; VCB: 300V
QI = MMPQ6700: Quad NPN and PNP General-Purpose Amplifier; Manufacturer: ON Semiconductor; Power: 180mW; IC: 200mA; VCEO: 40V; ComponentLink1Description: ON semiconductor product information; ComponentLink1URL: https://www.onsemi.com/PowerSolutions/product.do?id=MMPQ6700; ComponentLink2Description: Datasheet; ComponentLink2URL: https://www.onsemi.com/pub/Collateral/MMPQ6700-D.PDF; PartNumber: MMPQ6700; Price: *; Supplier: *; VCB: 40V
R1 R2 R5 R6 = Resistor 0.1 2W 5%: Resistor 0.1Ω 2W 5%; Tolerance: 5%; Price: *; Supplier: *; Type: (TH) Carbon film
R3 R4 = Cemented resistor 0.15 5W 5%: Cemented resistor 0.15Ω 5% 5W; Tolerance: 5%; Supplier: *; Price: *
R7 R8 = Resistor 68 1/4W 1%: Resistor 68Ω 1/4W 1%; Power: 1/4W; Price: *; Type: (TH) Metal film; Supplier: *
R9-R12 R17 R18 = Resistor 100 1/4W 1%: Resistor 100Ω 1/4W 1%; Power: 1/4W; Price: *; Supplier: *; Type: (TH) Metal film
R13 R14 = Resistor 22K 1/4W 1%: Resistor 22KΩ 1/4W 1%; Price: *; Supplier: *; Type: (TH) Metal film; Power: 1/4W
R15 R16 = Resistor 30 1/4W 1%: Resistor 30Ω 1/4W 1%; Power: 1/4W; Price: *; Supplier: *; Type: (TH) Metal film
R19 R20 = Resistor 360 1/4W 1%: Resistor 360Ω 1/4W 1%; Power: 1/4W; Price: *; Supplier: *; Type: (TH) Metal film
R21 R22 = Resistor 510 1/4W 1%: Resistor 510Ω 1/4W 1%; Power: 1/4W; Price: *; Supplier: *; Type: (TH) Metal film
R31 R32 = Resistor 16K 1/4W 1%: Resistor 16KΩ 1/4W 1%; Price: *; Supplier: *; Type: (TH) Metal film; Power: 1/4W
R33 R34 = RC0805FR-07150RL: RES 150R SM0805 YAGEO RC_L; Power (Watts): 0.125; Resistance (Ohms): 150; Tolerance (%): 1; Category: Resistor; Manufacturer: Yageo; Manufacturer Part Number: RC0805FR-07150RL; Package: 0805; Value: 150R; Supplier Part Number 1: 9237380; Supplier 1: Farnell; ComponentLink1Description: Manufacturer Website; ComponentLink1URL: http://www.yageo.com; Supplier 2: Digi-Key; Supplier Part Number 2: 311-150CRCT-ND
R35 R36 = Resistor 15K 1/4W 1%: Resistor 15KΩ 1/4W 1%; Power: 1/4W; Price: *; Supplier: *; Type: (TH) Metal film
R37 R38 = RC0603FR-071K2L: RES 1K2 SM0603 YAGEO RC_L; Power (Watts): 0.1; Resistance (Ohms): 1200; Tolerance (%): 1; Category: Resistor; Manufacturer: Yageo; Manufacturer Part Number: RC0603FR-071K2L; Package: 0603; Value: 1K2; Supplier Part Number 1: 9238492; Supplier 1: Farnell; ComponentLink1URL: http://www.yageo.com; ComponentLink1Description: Manufacturer Website; Supplier 2: Digi-Key; Supplier Part Number 2: 311-1.20KHRCT-ND
RF1 RF2 = Resistor 15 1/4W 1%: Resistor 15Ω 1/4W 1%; Power: 1/4W; Price: *; Supplier: *; Type: (TH) Metal film
RFB1 RIOF = Resistor 36K 1/4W 1%: Resistor 36KΩ 1/4W 1%; Power: 1/4W; Price: *; Supplier: *
  RFB1: Type: (TH) Metal film
RFB2 = Resistor 1.3k 1/4W 1%: Resistor 1.3kΩ 1/4W 1%; Power: 1/4W; Price: *; Supplier: *; Type: (TH) Metal film
RL1 = Resistor 20K 1W 5%: Resistor 20KΩ 1W 5%; Tolerance: 5%; Price: *; Supplier: *; Type: (TH) Carbon film
RL2 = Resistor 5.6K 1/2W 5%: Resistor 5.6KΩ 1/2W 5%; Tolerance: 5%; Price: *; Type: (TH) Metal film; Supplier: *
RMVM = Resistor 1.2k 1/4W 1%: Resistor 1.2kΩ 1/4W 1%; Power: 1/4W; Price: *; Supplier: *; Type: (TH) Metal film
RV1 = RES_TRIMMER_100_25T_VERTICAL: Tolerance: ±10%; Ratings: 1/2W; ±100ppm/°C; Material: Cermet; Supplier: *; Power: *; Price: *
RV2 = RES_TRIMMER_100_25T_VERTICAL: Tolerance: ±10%; Ratings: 1/2W; ±100ppm/°C; value: 100; Material: Cermet; Supplier: *; Power: *; Price: *
RVC1 RVC2 = RES_TRIMMER_2K_25T_VERTICAL: Tolerance: ±10%; Ratings: 1/2W; ±100ppm/°C; Material: Cermet; Supplier: *; Power: *; Price: *; value: 2k
RVMV = RES_TRIMMER_1K_25T_VERTICAL: Tolerance: ±10%; Ratings: 1/2W; ±100ppm/°C; Material: Cermet; Supplier: *; Power: *; Price: *; value: 1k
TP1-TP12 TP+HV TP+LV TP+RLV TP-HV TP-LV TP-RLV TPGND TPIN TPOUT = TESTPOINT_THT: Test Point PCB mount Multi-purpose Black; Manufacturer 1: Keystone Electronics; Manufacturer Part Number 1: 5014; PBL Part Number: 3100-xxx; Description 1: TEST POINT PC MULTI PURPOSE YEL; Supplier 1: Digi-Key; Supplier Part Number 1: 5014K-ND; Mounting Type: 0.063" (1.600mm) Hole Diameter; Material: Base, Nylon 46, UL 94V-0
TPMIDMV = Pin: Jumper Wire; Published: 24-Mar-1999; LatestRevisionDate: 17-Jul-2002; LatestRevisionNote: Re-released for DXP Platform.; PackageReference: RAD-0.2; Publisher: Altium Limited; PackageDescription: Radial Cap, Thru-Hole; 2 Leads; 0.2 in Pin Spacing